# Altium schematic sheet MCU.SchDoc
size A3
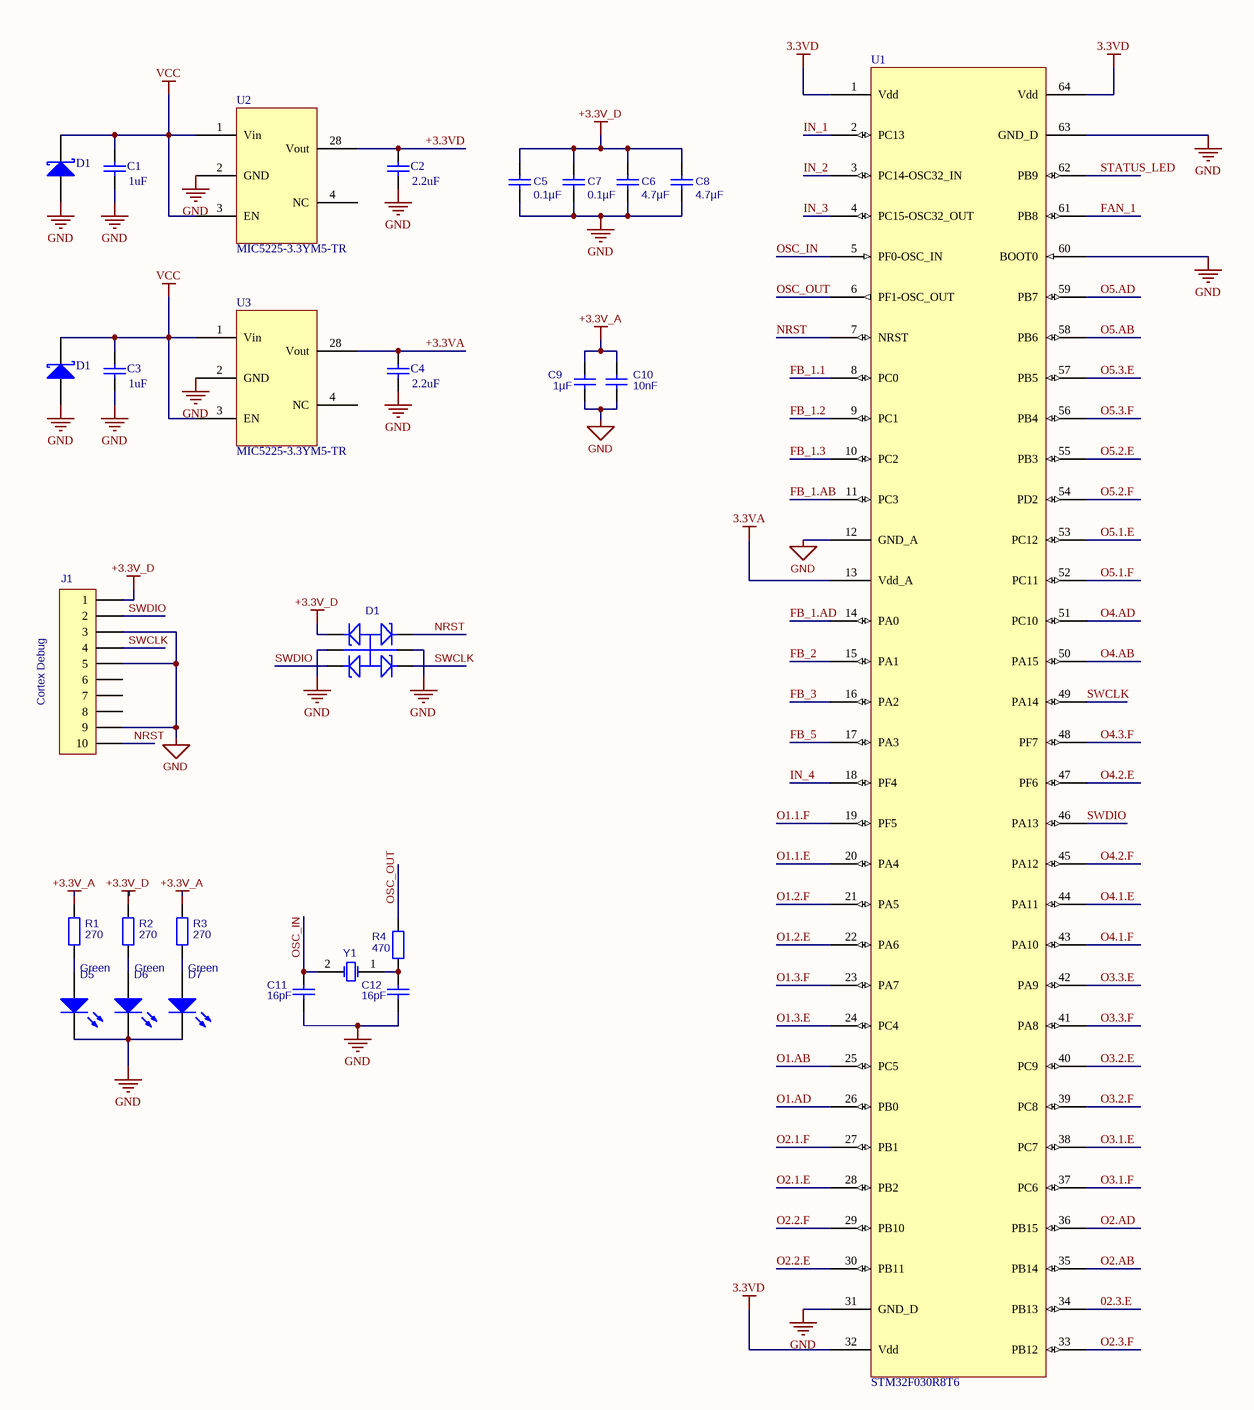
[diagram p0: MCU.SchDoc]

## Parts
(Parts that share a designator on the sheet are numbered #1, #2 ... from top to bottom, then left to right.)
C1  value 1uF  [RAD-0.3]
C2  value 2.2uF  [RAD-0.3]
C3  value 1uF  [RAD-0.3]
C4  value 2.2uF  [RAD-0.3]
C5  value 0.1µF  [TDK C-Series (1608)]
C6  value 4.7µF  [TDK C-Series (1608)]  (hidden comment: Cap)
C7  value 0.1µF  [TDK C-Series (1608)]
C8  value 4.7µF  [TDK C-Series (1608)]  (hidden comment: Cap)
C9  value 1µF  [TDK C-Series (1608)]
C10  value 10nF  [TDK C-Series (1608)]
C11  value 16pF  [Johanson S-Series (1608)]
C12  value 16pF  [Johanson S-Series (1608)]
D1#1  (no value)  [TO-220AC]
D1#2  (no value)  [TO-220AC]
D1#3  PESDxS4UD-Series  [NXP PESDxS4UD-Series (SOT-457)]  (value not drawn)
D5  LTST-C193KGKT-5A  [Lite-On LTST-C193K-Series (1608)]  (value not drawn)
D6  LTST-C193KGKT-5A  [Lite-On LTST-C193K-Series (1608)]  (value not drawn)
D7  LTST-C193KGKT-5A  [Lite-On LTST-C193K-Series (1608)]  (value not drawn)
J1  Samtec FTSH-105-01-L-DV-K  [Samtec FTSH-105-01-L-DV-K]  (value not drawn)
R1  value 270  [Panasonic ERJ-Series (1608)]
R2  value 270  [Panasonic ERJ-Series (1608)]
R3  value 270  [Panasonic ERJ-Series (1608)]
R4  value 470  [Panasonic ERJ-Series (1608)]
U1  STM32F030R8T6
U2  MIC5225-3.3YM5-TR
U3  MIC5225-3.3YM5-TR
Y1  (no value)  [Abracon ABM3-8.000MHZ-D2Y-T (2-DFN)]

## Nets
3.3VA: U1.13(Vdd_A)
3.3VD: U1.1(Vdd) U1.32(Vdd) U1.64(Vdd)
+3.3V_A: C9.2 C10.2 R1.2 R3.2
+3.3V_D: C5.2 C6.2 C7.2 C8.2 D1#3.1 J1.1 R2.2
GND: C1.1 C2.1 C3.1 C4.1 C5.1 C6.1 C7.1 C8.1 C9.1 C10.1 C11.2 C12.2 D1#1.3(A) D1#2.3(A) D1#3.2 D1#3.5 D5.2(K) D6.2(K) D7.2(K) J1.3 J1.5 J1.9 U1.12(GND_A) U1.31(GND_D) U1.60(BOOT0) U1.63(GND_D) U2.2(GND) U3.2(GND)
VCC: C1.2 C3.2 D1#1.1(K) D1#2.1(K) U2.1(Vin) U2.3(EN) U3.1(Vin) U3.3(EN)
02.3.E: U1.34(PB13)
+3.3VA: C4.2 U3.28(Vout)
+3.3VD: C2.2 U2.28(Vout)
FAN_1: U1.61(PB8)
FB_1.1: U1.8(PC0)
FB_1.2: U1.9(PC1)
FB_1.3: U1.10(PC2)
FB_1.AB: U1.11(PC3)
FB_1.AD: U1.14(PA0)
FB_2: U1.15(PA1)
FB_3: U1.16(PA2)
FB_5: U1.17(PA3)
IN_1: U1.2(PC13)
IN_2: U1.3(PC14-OSC32_IN)
IN_3: U1.4(PC15-OSC32_OUT)
IN_4: U1.18(PF4)
NRST: D1#3.6 J1.10 U1.7(NRST)
O1.1.E: U1.20(PA4)
O1.1.F: U1.19(PF5)
O1.2.E: U1.22(PA6)
O1.2.F: U1.21(PA5)
O1.3.E: U1.24(PC4)
O1.3.F: U1.23(PA7)
O1.AB: U1.25(PC5)
O1.AD: U1.26(PB0)
O2.1.E: U1.28(PB2)
O2.1.F: U1.27(PB1)
O2.2.E: U1.30(PB11)
O2.2.F: U1.29(PB10)
O2.3.F: U1.33(PB12)
O2.AB: U1.35(PB14)
O2.AD: U1.36(PB15)
O3.1.E: U1.38(PC7)
O3.1.F: U1.37(PC6)
O3.2.E: U1.40(PC9)
O3.2.F: U1.39(PC8)
O3.3.E: U1.42(PA9)
O3.3.F: U1.41(PA8)
O4.1.E: U1.44(PA11)
O4.1.F: U1.43(PA10)
O4.2.E: U1.47(PF6)
O4.2.F: U1.45(PA12)
O4.3.F: U1.48(PF7)
O4.AB: U1.50(PA15)
O4.AD: U1.51(PC10)
O5.1.E: U1.53(PC12)
O5.1.F: U1.52(PC11)
O5.2.E: U1.55(PB3)
O5.2.F: U1.54(PD2)
O5.3.E: U1.57(PB5)
O5.3.F: U1.56(PB4)
O5.AB: U1.58(PB6)
O5.AD: U1.59(PB7)
OSC_IN: C11.1 U1.5(PF0-OSC_IN) Y1.2(OSC2)
OSC_OUT: R4.2 U1.6(PF1-OSC_OUT)
STATUS_LED: U1.62(PB9)
SWCLK: D1#3.4 J1.4 U1.49(PA14)
SWDIO: D1#3.3 J1.2 U1.46(PA13)
NetC12_1: C12.1 R4.1 Y1.1(OSC1)
NetD5_1: D5.1(A) R1.1
NetD6_1: D6.1(A) R2.1
NetD7_1: D7.1(A) R3.1

Not connected (* = marked no-connect by the designer): J1 6 7 8; U2 4(NC); U3 4(NC)

## Notes on the sheet
- (near J1) Cortex Debug
- Green

## Library data of the parts
C1-C12 = Cap: Capacitor; Published: 8-Jun-2000; LatestRevisionDate: 17-Jul-2002; LatestRevisionNote: Re-released for DXP Platform.; PackageReference: RAD-0.3; Publisher: Altium Limited; PackageDescription: Radial Cap, Thru-Hole; 2 Leads; 0.3 in Pin Spacing; Supplier 1: Digi-Key
  C1 C3: Supplier 2: Digi-Key; Supplier Part Number 2: 445-5146-1-ND
  C2 C4: Supplier 2: Digi-Key; Supplier Part Number 2: 445-5964-1-ND
  C5 C7: Supplier Part Number 1: 445-1316-1-ND
  C6 C8: Supplier Part Number 1: 445-7482-1-ND
  C9: Supplier Part Number 1: 445-5956-1-ND
  C10: Supplier Part Number 1: 445-1304-1-ND
  C11 C12: Supplier Part Number 1: 712-1320-1-ND
D1#1 D1#2 = Diode 10TQ035: Schottky Rectifier; Note: Terminal 2 is the TAB and is electrically connected to the cathode; Published: 8-Jun-2000; LatestRevisionDate: 17-Jul-2002; LatestRevisionNote: Re-released for DXP Platform.; DatasheetVersion: PD-2.057B; PackageVersion: Feb-1998; PackageReference: TO-220AC; Publisher: Altium Limited; PackageDescription: TO, Thru-Hole, Vertical, Heatsink Mounted; 3 In-Line Leads (1 Absent); Pitch 2.54 mm; ComponentLink1Description: Manufacturer Link; ComponentLink1URL: http://www.irf.com/; ComponentLink2Description: Datasheet; ComponentLink2URL: http://www.irf.com/product-info/datasheets/data/10tq.pdf; Supplier 1: Digi-Key; Supplier 2: Digi-Key; Supplier Part Number 2: SMBJ8.0D-M3/HGICT-ND
D1#3 = NXP PESDxS4UD-Series: 200W Quad TVS Diode Array; Supplier 1: Digi-Key; Supplier Part Number 1: 568-4266-1-ND
D5-D7 = LED0: Typical INFRARED GaAs LED; Published: 8-Jun-2000; LatestRevisionDate: 08-Jul-2005; LatestRevisionNote: Mech Layer 1 removed.; PackageReference: LED-0; Publisher: Altium Limited; PackageDescription: LED; 2 Leads; Supplier 1: Digi-Key; Supplier Part Number 1: 160-1828-1-ND
J1 = Samtec FTSH-105-01-L-DV-K: 10-Pin 1.27mm Shrouded Cortex Debug Connector; Supplier 1: Digi-Key; Supplier Part Number 1: SAM8796-ND
R1-R4 = Res2: Resistor; Published: 8-Jun-2000; LatestRevisionDate: 17-Jul-2002; LatestRevisionNote: Re-released for DXP Platform.; PackageReference: AXIAL-0.4; Publisher: Altium Limited; PackageDescription: Axial Device, Thru-Hole; 2 Leads; 0.4 in Pin Spacing; Supplier 1: Digi-Key
  R1-R3: Supplier Part Number 1: P270HCT-ND
  R4: Supplier Part Number 1: P470HCT-ND
Y1 = XTAL: Crystal Oscillator; Published: 8-Jun-2000; LatestRevisionDate: 17-Jul-2002; LatestRevisionNote: Re-released for DXP Platform.; PackageReference: R38; Publisher: Altium Limited; PackageDescription: Crystal, Thru-Hole; 2 Leads; Body 3.1 x 8.2 mm (Dia.xH); Supplier 1: Digi-Key; Supplier Part Number 1: 535-10630-1-ND
U1 = STM32F030R8T6: Supplier 1: Digi-Key; Supplier Part Number 1: 497-14045-ND